# EAGLE schematic composite_router_draft_1 (EAGLE 7.2.0)
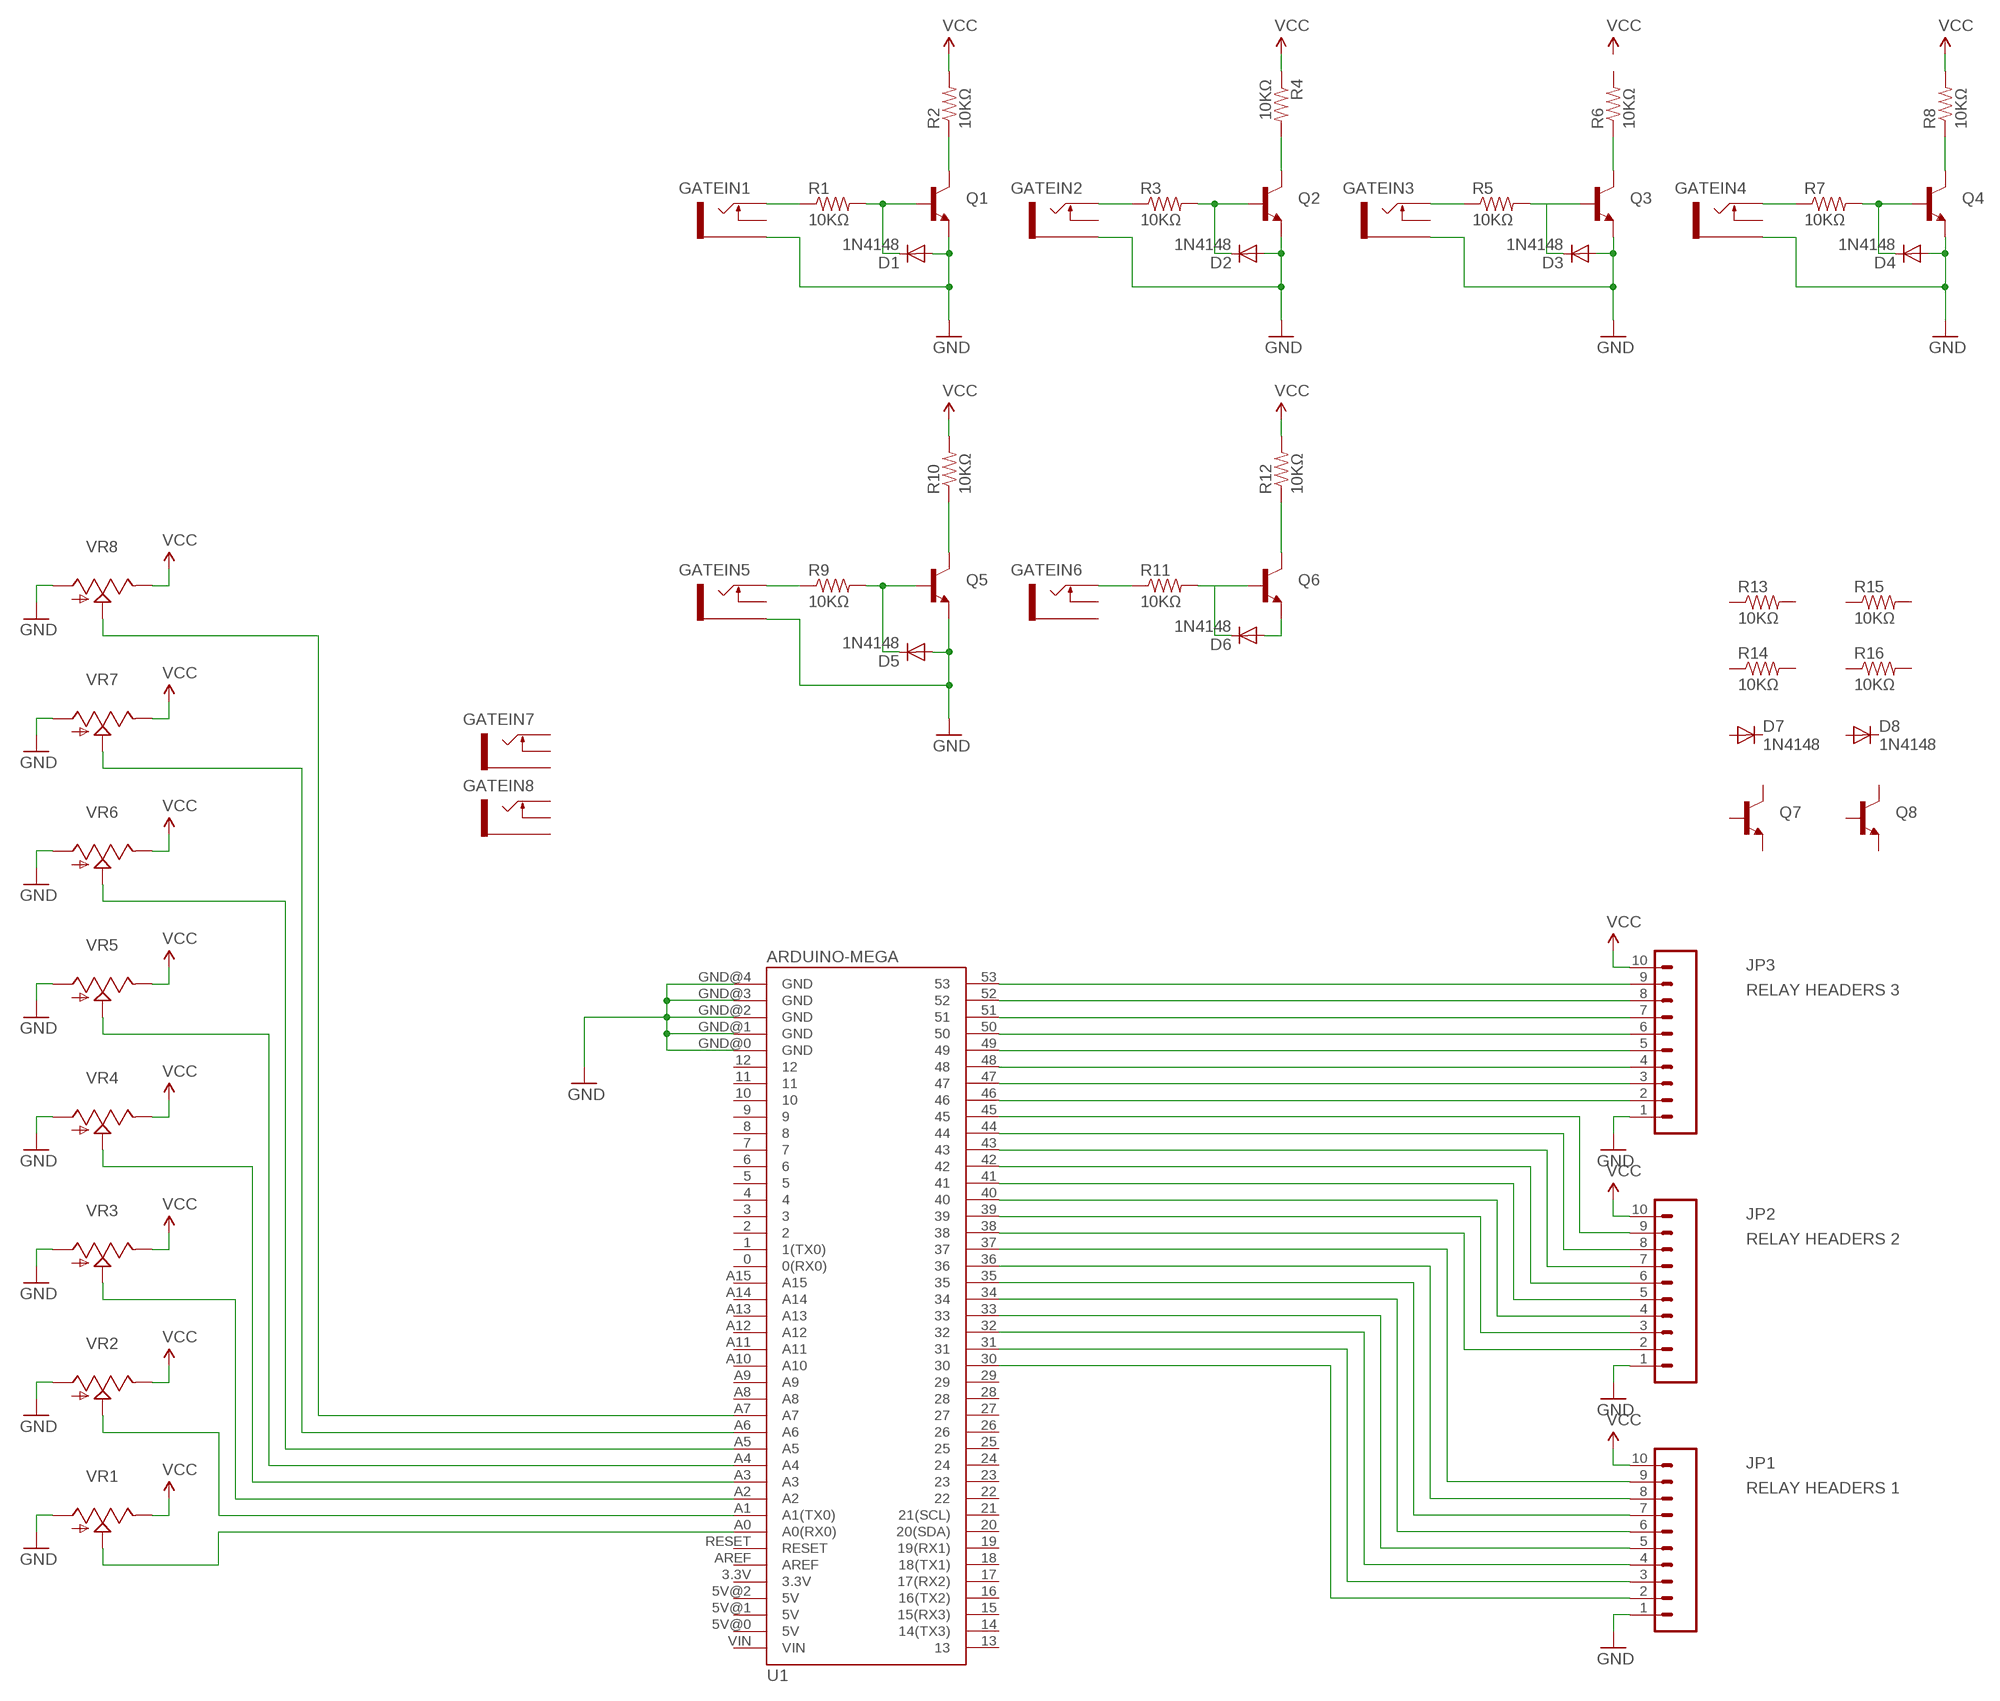
[diagram p0: schematic, sheet 1]

## Parts
D1  1N4148  1N4148DO35-7  [DO35-7]
D2  1N4148  1N4148DO35-7  [DO35-7]
D3  1N4148  1N4148DO35-7  [DO35-7]
D4  1N4148  1N4148DO35-7  [DO35-7]
D5  1N4148  1N4148DO35-7  [DO35-7]
D6  1N4148  1N4148DO35-7  [DO35-7]
D7  1N4148  1N4148DO35-7  [DO35-7]
D8  1N4148  1N4148DO35-7  [DO35-7]
GATEIN1  THONKICONNNEW  [WQP-PJ301M-12_JACK]
GATEIN2  THONKICONNNEW  [WQP-PJ301M-12_JACK]
GATEIN3  THONKICONNNEW  [WQP-PJ301M-12_JACK]
GATEIN4  THONKICONNNEW  [WQP-PJ301M-12_JACK]
GATEIN5  THONKICONNNEW  [WQP-PJ301M-12_JACK]
GATEIN6  THONKICONNNEW  [WQP-PJ301M-12_JACK]
GATEIN7  THONKICONNNEW  [WQP-PJ301M-12_JACK]
GATEIN8  THONKICONNNEW  [WQP-PJ301M-12_JACK]
JP1  RELAY HEADERS 1  M10SILK_FEMALE_PTH  [1X10]
JP2  RELAY HEADERS 2  M10SILK_FEMALE_PTH  [1X10]
JP3  RELAY HEADERS 3  M10SILK_FEMALE_PTH  [1X10]
Q1  TRANSISTOR_NPN2N3904  [TO-92]
Q2  TRANSISTOR_NPN2N3904  [TO-92]
Q3  TRANSISTOR_NPN2N3904  [TO-92]
Q4  TRANSISTOR_NPN2N3904  [TO-92]
Q5  TRANSISTOR_NPN2N3904  [TO-92]
Q6  TRANSISTOR_NPN2N3904  [TO-92]
Q7  TRANSISTOR_NPN2N3904  [TO-92]
Q8  TRANSISTOR_NPN2N3904  [TO-92]
R1  10KΩ  RESISTORPTH-1/4W  [AXIAL-0.4]
R2  10KΩ  RESISTORPTH-1/4W  [AXIAL-0.4]
R3  10KΩ  RESISTORPTH-1/4W  [AXIAL-0.4]
R4  10KΩ  RESISTORPTH-1/4W  [AXIAL-0.4]
R5  10KΩ  RESISTORPTH-1/4W  [AXIAL-0.4]
R6  10KΩ  RESISTORPTH-1/4W  [AXIAL-0.4]
R7  10KΩ  RESISTORPTH-1/4W  [AXIAL-0.4]
R8  10KΩ  RESISTORPTH-1/4W  [AXIAL-0.4]
R9  10KΩ  RESISTORPTH-1/4W  [AXIAL-0.4]
R10  10KΩ  RESISTORPTH-1/4W  [AXIAL-0.4]
R11  10KΩ  RESISTORPTH-1/4W  [AXIAL-0.4]
R12  10KΩ  RESISTORPTH-1/4W  [AXIAL-0.4]
R13  10KΩ  RESISTORPTH-1/4W  [AXIAL-0.4]
R14  10KΩ  RESISTORPTH-1/4W  [AXIAL-0.4]
R15  10KΩ  RESISTORPTH-1/4W  [AXIAL-0.4]
R16  10KΩ  RESISTORPTH-1/4W  [AXIAL-0.4]
U1  ARDUINO-MEGA  ARDUINO-MEGAFULL  [ARDUINO_MEGA]
VR1  9MM_SNAP-IN_POT_  [9MM_SNAP-IN_POT]
VR2  9MM_SNAP-IN_POT_  [9MM_SNAP-IN_POT]
VR3  9MM_SNAP-IN_POT_  [9MM_SNAP-IN_POT]
VR4  9MM_SNAP-IN_POT_  [9MM_SNAP-IN_POT]
VR5  9MM_SNAP-IN_POT_  [9MM_SNAP-IN_POT]
VR6  9MM_SNAP-IN_POT_  [9MM_SNAP-IN_POT]
VR7  9MM_SNAP-IN_POT_  [9MM_SNAP-IN_POT]
VR8  9MM_SNAP-IN_POT_  [9MM_SNAP-IN_POT]

## Nets
GND: D1.A D2.A D3.A D4.A D5.A GATEIN1.P$3_SLEEVE(SLEEVE) GATEIN2.P$3_SLEEVE(SLEEVE) GATEIN3.P$3_SLEEVE(SLEEVE) GATEIN4.P$3_SLEEVE(SLEEVE) GATEIN5.P$3_SLEEVE(SLEEVE) JP1.1 JP2.1 JP3.1 Q1.1(E) Q2.1(E) Q3.1(E) Q4.1(E) Q5.1(E) U1.GND@0(GND) U1.GND@1(GND) U1.GND@2(GND) U1.GND@3(GND) U1.GND@4(GND) VR1.1(A) VR2.1(A) VR3.1(A) VR4.1(A) VR5.1(A) VR6.1(A) VR7.1(A) VR8.1(A)
N$1: JP3.9 U1.53
N$2: JP3.8 U1.52
N$3: JP3.7 U1.51
N$4: JP3.6 U1.50
N$5: JP3.5 U1.49
N$6: JP3.4 U1.48
N$7: JP3.3 U1.47
N$8: JP3.2 U1.46
N$9: JP2.9 U1.45
N$10: JP2.8 U1.44
N$11: JP2.7 U1.43
N$12: JP2.6 U1.42
N$13: JP2.5 U1.41
N$14: JP2.4 U1.40
N$15: JP2.3 U1.39
N$16: JP2.2 U1.38
N$17: JP1.9 U1.37
N$18: JP1.8 U1.36
N$19: JP1.7 U1.35
N$20: JP1.6 U1.34
N$21: JP1.5 U1.33
N$22: JP1.4 U1.32
N$23: JP1.3 U1.31
N$24: JP1.2 U1.30
N$25: GATEIN1.P$1_TIP(TIP) R1.P$1
N$26: U1.A0(A0(RX0)) VR1.2(S)
N$27: U1.A1(A1(TX0)) VR2.2(S)
N$28: U1.A2 VR3.2(S)
N$29: U1.A3 VR4.2(S)
N$30: U1.A4 VR5.2(S)
N$31: U1.A5 VR6.2(S)
N$32: U1.A6 VR7.2(S)
N$33: U1.A7 VR8.2(S)
N$34: D1.C Q1.2(B) R1.P$2
N$35: GATEIN3.P$1_TIP(TIP) R5.P$1
N$36: D3.C Q3.2(B) R5.P$2
N$37: Q1.3(C) R2.P$1
N$38: D2.C Q2.2(B) R3.P$2
N$39: Q2.3(C) R4.P$2
N$40: GATEIN2.P$1_TIP(TIP) R3.P$1
N$41: Q3.3(C) R6.P$1
N$44: GATEIN4.P$1_TIP(TIP) R7.P$1
N$45: D4.C Q4.2(B) R7.P$2
N$46: Q4.3(C) R8.P$1
N$48: GATEIN5.P$1_TIP(TIP) R9.P$1
N$49: D5.C Q5.2(B) R9.P$2
N$50: Q5.3(C) R10.P$1
N$53: GATEIN6.P$1_TIP(TIP) R11.P$1
N$54: D6.C Q6.2(B) R11.P$2
N$55: Q6.3(C) R12.P$1
N$56: D6.A Q6.1(E)
VCC: JP1.10 JP2.10 JP3.10 R2.P$2 R4.P$1 R8.P$2 R10.P$2 R12.P$2 VR1.3(E) VR2.3(E) VR3.3(E) VR4.3(E) VR5.3(E) VR6.3(E) VR7.3(E) VR8.3(E)
Unconnected: D7.A D7.C D8.A D8.C GATEIN1.P$2_SWITCH(SWITCH) GATEIN2.P$2_SWITCH(SWITCH) GATEIN3.P$2_SWITCH(SWITCH) GATEIN4.P$2_SWITCH(SWITCH) GATEIN5.P$2_SWITCH(SWITCH) GATEIN6.P$2_SWITCH(SWITCH) GATEIN6.P$3_SLEEVE(SLEEVE) GATEIN7.P$1_TIP(TIP) GATEIN7.P$2_SWITCH(SWITCH) GATEIN7.P$3_SLEEVE(SLEEVE) GATEIN8.P$1_TIP(TIP) GATEIN8.P$2_SWITCH(SWITCH) GATEIN8.P$3_SLEEVE(SLEEVE) Q7.1(E) Q7.2(B) Q7.3(C) Q8.1(E) Q8.2(B) Q8.3(C) R6.P$2 R13.P$1 R13.P$2 R14.P$1 R14.P$2 R15.P$1 R15.P$2 R16.P$1 R16.P$2 U1.0(0(RX0)) U1.1(1(TX0)) U1.2 U1.3 U1.3.3V U1.4 U1.5 U1.5V@0(5V) U1.5V@1(5V) U1.5V@2(5V) U1.6 U1.7 U1.8 U1.9 U1.10 U1.11 U1.12 U1.13 U1.14(14(TX3)) U1.15(15(RX3)) U1.16(16(TX2)) U1.17(17(RX2)) U1.18(18(TX1)) U1.19(19(RX1)) U1.20(20(SDA)) U1.21(21(SCL)) U1.22 U1.23 U1.24 U1.25 U1.26 U1.27 U1.28 U1.29 U1.A8 U1.A9 U1.A10 U1.A11 U1.A12 U1.A13 U1.A14 U1.A15 U1.AREF U1.RESET U1.VIN

## Library data of the parts
D1-D8 = diode:1N4148: DIODE high speed (Philips)
GATEIN1-GATEIN8 = MusicThingModular:THONKICONN: 3.5mm socket for Eurorack modular synths
JP1-JP3 = SparkFun-Connectors:M10: Header 10 Standard 10-pin 0.1" header. Use with straight break away headers (SKU : PRT-00116), right angle break away headers (PRT-00553), swiss pins (PRT-00743), machine pins (PRT-00117), and female headers (PRT-00115).; PROD_ID: CONN-11563
Q1-Q8 = SparkFun-DiscreteSemi:TRANSISTOR_NPN: Generic NPN BJT MMBT2222A - TRANS-08049 (SOT-23, 1A 40V) MPSA42 - TRANS-09116 (SOT-23, 500mA 300V) MMBT5088LT1G - TRANS-11160 (SOT-23, 50 mA 30V) BC547 - COM-08928 <http://www.sparkfun.com/products/8928> (TO-92 45V 100mA) (1.Collector 2.Base 3.Emitter) 2N3904 - COM-00521 <http://www.sparkfun.com/products/521> (TO-92 40V 200mA) (1.Emitter 2.Base 3.Collector) P2N2222A - COM-12852 <http://www.sparkfun.com/products/12852> (TO-92 40V 600mA) (1.Collector 2.Base 3.Emitter); PROD_ID: TRANS-08447
R1-R16 = SparkFun-Passives:RESISTOR: Resistor Basic schematic elements and footprints for 0603, 1206, and PTH resistors.
U1 = SparkFun-Boards:ARDUINO-MEGA: Arduino Mega board footprint
VR1-VR8 = MusicThingModular:9MM_SNAP-IN_POT: 9mm vertical snap-in pot, Alpha / Panasonic style